# Altium schematic sheet BlockDiagram.SchDoc
size A2; ApprovedBy: Siz Değerli Öğrenciler; CheckedBy: UDEMY; Organization: Altium Limited; Address1: L3, 12a Rodborough Rd; Address2: Frenchs Forest; Address3: NSW; Address4: Australia 2086; DocumentNumber: 2; Revision: AA; SheetNumber: 2; SheetTotal: 10; PreparedBy: M. Berk AYDOĞAN; ChangedDate: 13.02.2021; ReleaseDate: 06.02.2021; ProjectDescription: Wireless Security Detector
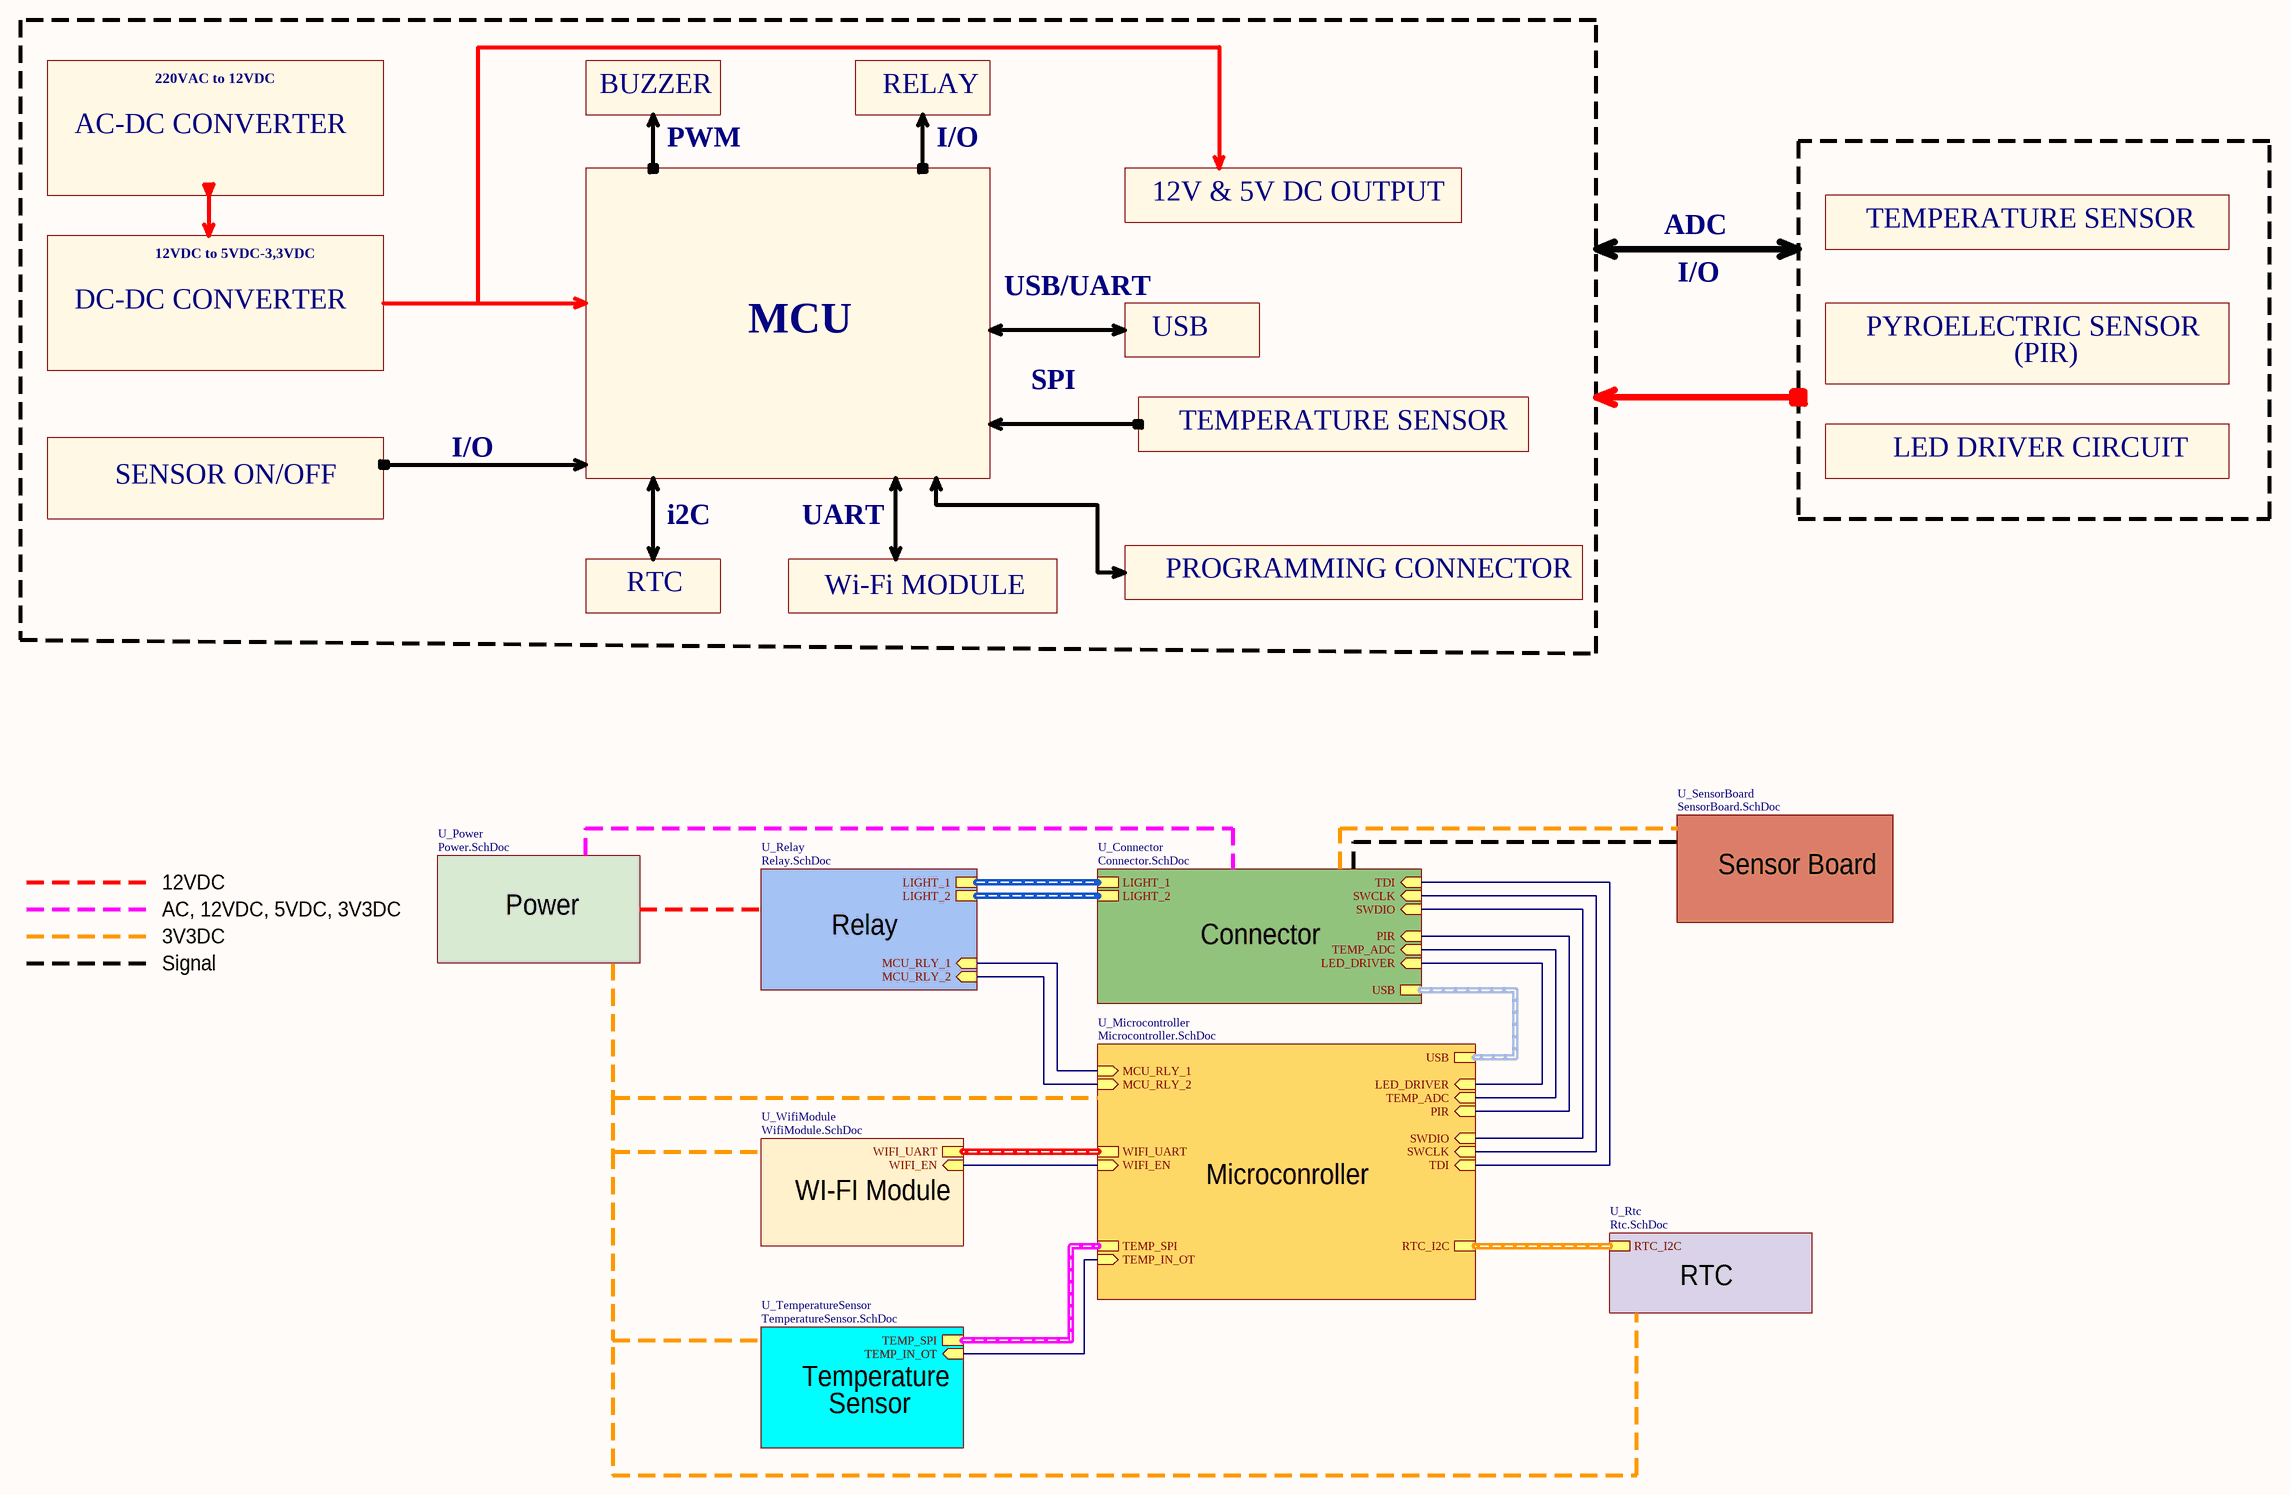
[diagram p0: BlockDiagram.SchDoc]

## Sub-sheets
U_Connector = Connector.SchDoc: USB (harness USB_H), LED_DRIVER (in), TEMP_ADC (in), PIR (in), SWDIO (in), SWCLK (in), TDI (in), LIGHT_1 (harness LIGHT_1_H), LIGHT_2 (harness LIGHT_2_H)
U_Microcontroller = Microcontroller.SchDoc: RTC_I2C (harness RTC_H), TEMP_SPI (harness TEMP_H), TEMP_IN_OT (in), WIFI_UART (harness WIFI_H), WIFI_EN (in), LED_DRIVER (in), TEMP_ADC (in), PIR (in), SWDIO (in), SWCLK (in), TDI (in), USB (harness USB_H), MCU_RLY_1 (in), MCU_RLY_2 (in)
U_Power = Power.SchDoc: no entries
U_Relay = Relay.SchDoc: MCU_RLY_1 (in), MCU_RLY_2 (in), LIGHT_1 (harness LIGHT_1_H), LIGHT_2 (harness LIGHT_2_H)
U_Rtc = Rtc.SchDoc: RTC_I2C (harness RTC_H)
U_SensorBoard = SensorBoard.SchDoc: no entries
U_TemperatureSensor = TemperatureSensor.SchDoc: TEMP_SPI (harness TEMP_H), TEMP_IN_OT (in)
U_WifiModule = WifiModule.SchDoc: WIFI_UART (harness WIFI_H), WIFI_EN (in)

## Nets
(unnamed): sheet U_Microcontroller/TEMP_IN_OT, sheet U_TemperatureSensor/TEMP_IN_OT
(unnamed): sheet U_Microcontroller/WIFI_EN, sheet U_WifiModule/WIFI_EN
(unnamed): sheet U_Microcontroller/LED_DRIVER, sheet U_Connector/LED_DRIVER
(unnamed): sheet U_Microcontroller/TEMP_ADC, sheet U_Connector/TEMP_ADC
(unnamed): sheet U_Microcontroller/PIR, sheet U_Connector/PIR
(unnamed): sheet U_Microcontroller/SWDIO, sheet U_Connector/SWDIO
(unnamed): sheet U_Microcontroller/SWCLK, sheet U_Connector/SWCLK
(unnamed): sheet U_Microcontroller/TDI, sheet U_Connector/TDI
(unnamed): sheet U_Microcontroller/MCU_RLY_1, sheet U_Relay/MCU_RLY_1
(unnamed): sheet U_Microcontroller/MCU_RLY_2, sheet U_Relay/MCU_RLY_2

## Buses and harness runs
harness sheet U_Connector/LIGHT_1 = sheet U_Relay/LIGHT_1
harness sheet U_Connector/LIGHT_2 = sheet U_Relay/LIGHT_2
harness sheet U_Connector/USB = sheet U_Microcontroller/USB
harness sheet U_Microcontroller/RTC_I2C = sheet U_Rtc/RTC_I2C
harness sheet U_Microcontroller/TEMP_SPI = sheet U_TemperatureSensor/TEMP_SPI
harness sheet U_Microcontroller/WIFI_UART = sheet U_WifiModule/WIFI_UART

## Notes on the sheet
- 220VAC to 12VDC
- BUZZER
- RELAY
- AC-DC CONVERTER
- PWM
- I/O
- 12V & 5V DC OUTPUT
- TEMPERATURE SENSOR
- 12VDC to 5VDC-3,3VDC
- USB/UART
- ADC
- DC-DC CONVERTER
- MCU
- USB
- PYROELECTRIC SENSOR
- (PIR)
- SPI
- SENSOR ON/OFF
- LED DRIVER CIRCUIT
- i2C
- UART
- RTC
- Wi-Fi MODULE
- PROGRAMMING CONNECTOR
- 12VDC
- Sensor Board
- AC, 12VDC, 5VDC, 3V3DC
- 3V3DC
- Signal
- Power
- Relay
- Connector
- WI-FI Module
- Microconroller
- Temperature
- Sensor
- Title
- Size:
- Date:
- File:
- A2
- Number:
- Time:
- Revision:
- Sheet
- of